# EAGLE design PCB (EAGLE 6.5.0)
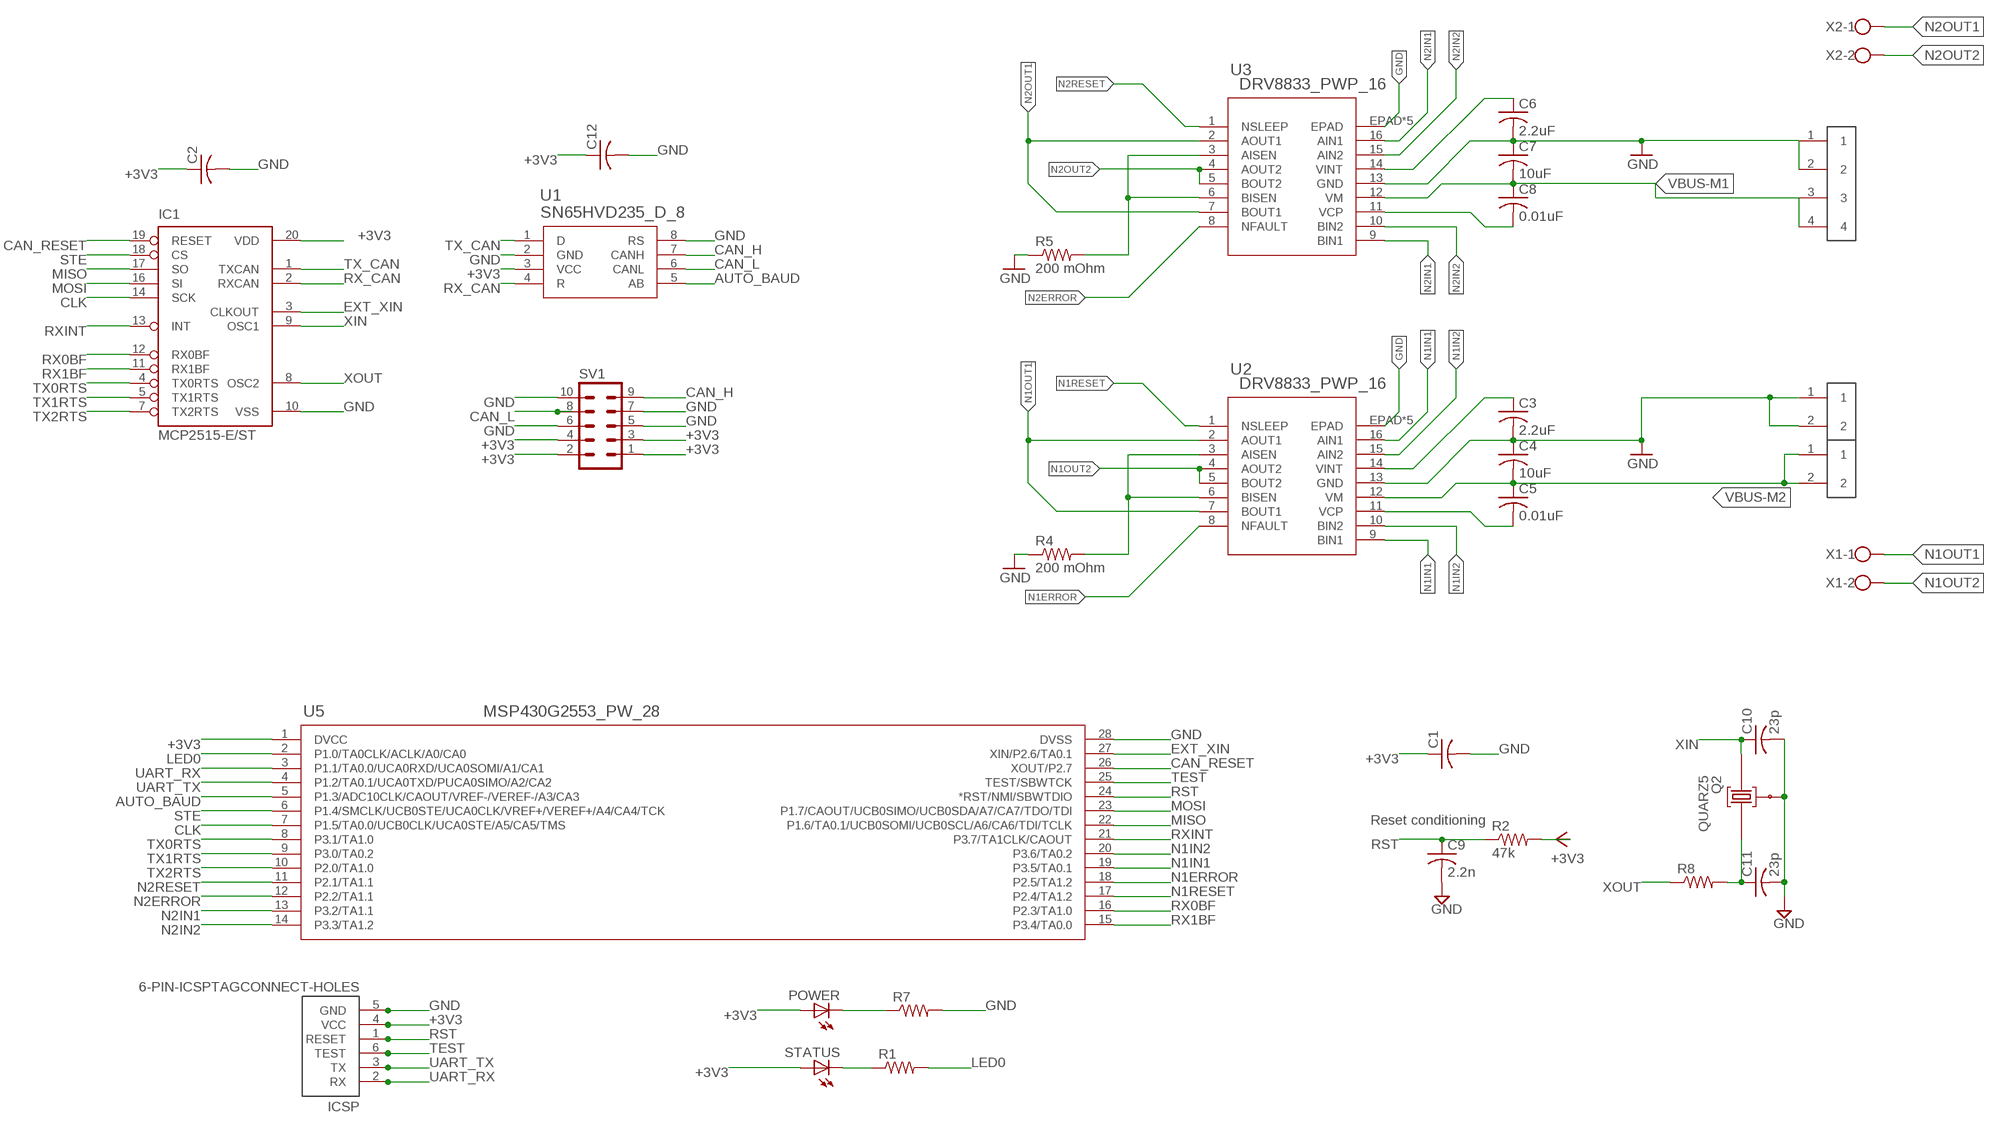
[diagram p0: schematic, sheet 1]

## Parts
C1  C-USC0603  [C0603]
C2  C-USC0603  [C0603]
C3  2.2uF  C-USC1206  [C1206]
C4  10uF  C-USC1206  [C1206]
C5  0.01uF  C-USC1206  [C1206]
C6  2.2uF  C-USC1206  [C1206]
C7  10uF  C-USC1206  [C1206]
C8  0.01uF  C-USC1206  [C1206]
C9  2.2n  C-USC0603  [C0603]
C10  23p  C-USC1206  [C1206]
C11  23p  C-USC1206  [C1206]
C12  C-USC0603  [C0603]
IC1  MCP2515-E/ST  [TSSOP20]
ICSP  6-PIN-ICSPTAGCONNECT-HOLES  [TAGCONNECT-HOLES]
POWER  LEDCHIP-LED0603  [CHIP-LED0603]
Q2  QUARZ5  [QUARZ5]
R1  R-US_R0603  [R0603]
R2  47k  R-US_R0603  [R0603]
R4  200 mOhm  R-US_R0805  [R0805]
R5  200 mOhm  R-US_R0805  [R0805]
R7  R-US_R0603  [R0603]
R8  R-US_R0603  [R0603]
STATUS  LEDCHIP-LED0603  [CHIP-LED0603]
SV1  MA05-2  [MA05-2]
U1  SN65HVD235_D_8  [D8]
U2  DRV8833_PWP_16  [PWP16_2P31X2P46]
U3  DRV8833_PWP_16  [PWP16_2P31X2P46]
U5  MSP430G2553_PW_28  [PW28]
U$2  1X4_HEADER  [1X4-.1HEADER]
U$3  1X2_HEADER  [1X2-.1HEADER]
U$4  1X2_HEADER  [1X2-.1HEADER]
X1  W237-102  [W237-102]
X2  W237-102  [W237-102]

## Nets
+3V3: C1.1 C2.1 C12.1 IC1.20(VDD) ICSP.4(VCC) POWER.A R2.2 STATUS.A SV1.1 SV1.2 SV1.3 SV1.4 U1.3(VCC) U5.1(DVCC)
AUTO_BAUD: U1.5(AB) U5.5(P1.3/ADC10CLK/CAOUT/VREF-/VEREF-/A3/CA3)
CAN_H: SV1.9 U1.7(CANH)
CAN_L: SV1.8 U1.6(CANL)
CAN_RESET: IC1.19(RESET) U5.26(XOUT/P2.7)
CLK: IC1.14(SCK) U5.7(P1.5/TA0.0/UCB0CLK/UCA0STE/A5/CA5/TMS)
EXT_XIN: IC1.3(CLKOUT) U5.27(XIN/P2.6/TA0.1)
GND: C1.2 C2.2 C3.2 C4.1 C6.2 C7.1 C9.2 C10.2 C11.2 C12.2 IC1.10(VSS) ICSP.5(GND) Q2.GND@0 R4.1 R5.1 R7.2 SV1.5 SV1.6 SV1.7 SV1.10 U1.2(GND) U1.8(RS) U2.13(GND) U2.EPAD U2.V(EPAD) U2.V_2(EPAD) U2.V_3(EPAD) U2.V_6(EPAD) U3.13(GND) U3.EPAD U3.V(EPAD) U3.V_2(EPAD) U3.V_3(EPAD) U3.V_6(EPAD) U5.28(DVSS) U$2.1 U$2.2 U$3.1 U$3.2
LED0: R1.2 U5.2(P1.0/TA0CLK/ACLK/A0/CA0)
MISO: IC1.17(SO) U5.22(P1.6/TA0.1/UCB0SOMI/UCB0SCL/A6/CA6/TDI/TCLK)
MOSI: IC1.16(SI) U5.23(P1.7/CAOUT/UCB0SIMO/UCB0SDA/A7/CA7/TDO/TDI)
N1ERROR: U2.8(NFAULT) U5.18(P2.5/TA1.2)
N1IN1: U2.9(BIN1) U2.16(AIN1) U5.19(P3.5/TA0.1)
N1IN2: U2.10(BIN2) U2.15(AIN2) U5.20(P3.6/TA0.2)
N1OUT1: U2.2(AOUT1) U2.7(BOUT1) X1.1
N1OUT2: U2.4(AOUT2) U2.5(BOUT2) X1.2
N1RESET: U2.1(NSLEEP) U5.17(P2.4/TA1.2)
N1SENSE: R4.2 U2.3(AISEN) U2.6(BISEN)
N1SENSE1: R5.2 U3.3(AISEN) U3.6(BISEN)
N1VINT: C3.1 U2.14(VINT)
N2ERROR: U3.8(NFAULT) U5.12(P2.2/TA1.1)
N2IN1: U3.9(BIN1) U3.16(AIN1) U5.13(P3.2/TA1.1)
N2IN2: U3.10(BIN2) U3.15(AIN2) U5.14(P3.3/TA1.2)
N2OUT1: U3.2(AOUT1) U3.7(BOUT1) X2.1
N2OUT2: U3.4(AOUT2) U3.5(BOUT2) X2.2
N2RESET: U3.1(NSLEEP) U5.11(P2.1/TA1.1)
N2VCP: C8.2 U3.11(VCP)
N2VINT: C6.1 U3.14(VINT)
N$2: R1.1 STATUS.C
N$4: C5.2 U2.11(VCP)
N$5: POWER.C R7.1
RST: C9.1 ICSP.1(RESET) R2.1 U5.24(*RST/NMI/SBWTDIO)
RX0BF: IC1.12(RX0BF) U5.16(P2.3/TA1.0)
RX1BF: IC1.11(RX1BF) U5.15(P3.4/TA0.0)
RX_CAN: IC1.2(RXCAN) U1.4(R)
RXINT: IC1.13(INT) U5.21(P3.7/TA1CLK/CAOUT)
STE: IC1.18(CS) U5.6(P1.4/SMCLK/UCB0STE/UCA0CLK/VREF+/VEREF+/A4/CA4/TCK)
TEST: ICSP.6(TEST) U5.25(TEST/SBWTCK)
TX0RTS: IC1.4(TX0RTS) U5.8(P3.1/TA1.0)
TX1RTS: IC1.5(TX1RTS) U5.9(P3.0/TA0.2)
TX2RTS: IC1.7(TX2RTS) U5.10(P2.0/TA1.0)
TX_CAN: IC1.1(TXCAN) U1.1(D)
UART_RX: ICSP.2(RX) U5.3(P1.1/TA0.0/UCA0RXD/UCA0SOMI/A1/CA1)
UART_TX: ICSP.3(TX) U5.4(P1.2/TA0.1/UCA0TXD/PUCA0SIMO/A2/CA2)
VBUS-M1: C7.2 C8.1 U3.12(VM) U$2.3 U$2.4
VBUS-M2: C4.2 C5.1 U2.12(VM) U$4.1 U$4.2
XIN: C10.1 IC1.9(OSC1) Q2.2
XOUT: IC1.8(OSC2) R8.1
XOUT_C: C11.1 Q2.1 R8.2

## Notes on the sheet
- Reset conditioning

## Library data of the parts
C1-C12 = adafruit:C-US: CAPACITOR, American symbol
IC1 = mcp2515:MCP2515
ICSP = LaunchFET:6-PIN-ICSP: 6 pin easy-msp formatted headers. Designed to make programming target boards with MSP430 Launchpad easier. EASYMSP: standard .05" pitch header to match launchpad SAFEMSP: .05" header with .025" offset Vcc to keep Geordi away
POWER STATUS = adafruit:LED: LED OSRAM: - CHIPLED LG R971, LG N971, LY N971, LG Q971, LY Q971, LO R971, LY R971 LH N974, LH R974 LS Q976, LO Q976, LY Q976 LO Q996 - Hyper CHIPLED LW Q18S LB Q993, LB Q99A, LB R99A - SideLED LS A670, LO A670, LY A670, LG A670, LP A670 LB A673, LV A673, LT A673, LW A673 LH A674 LY A675 LS A676, LA A676, LO A676, LY A676, LW A676 LS A679, LY A679, LG A679 - Hyper Micro SIDELED® LS Y876, LA Y876, LO Y876, LY Y876 LT Y87S - SmartLED LW L88C, LW L88S LB L89C, LB L89S, LG L890 LS L89K, LO L89K, LY L89K LS L896, LA L896, LO L896, LY L896 - TOPLED LS T670, LO T670, LY T670, LG T670, LP T670 LSG T670, LSP T670, LSY T670, LOP T670, LYG T670 LG T671, LOG T671, LSG T671 LB T673, LV T673, LT T673, LW T673 LH T674 LS T676, LA T676, LO T676, LY T676, LB T676, LH T676, LSB T676, LW T676 LB T67C, LV T67C, LT T67C, LS T67K, LO T67K, LY T67K, LW E67C LS E67B, LA E67B, LO E67B, LY E67B, LB E67C, LV E67C, LT E67C LW T67C LS T679, LY T679, LG T679 LS T770, LO T770, LY T770, LG T770, LP T770 LB T773, LV T773, LT T773, LW T773 LH T774 LS E675, LA E675, LY E675, LS T675 LS T776, LA T776, LO T776, LY T776, LB T776 LHGB T686 LT T68C, LB T68C - Hyper Mini TOPLED® LB M676 - Mini TOPLED Santana® LG M470 LS M47K, LO M47K, LY M47K Source: http://www.osram.convergy.de/
Q2 = sMSP430:QUARZ5
R1 R2 R4 R5 R7 R8 = adafruit:R-US_: RESISTOR, American symbol
SV1 = con-lstb:MA05-2: PIN HEADER; OC_FARNELL: unknown; OC_NEWARK: unknown
U1 = TexasInstruments:SN65HVD235_D_8; DATASHEETURL: http://www.ti.com/lit/gpn/SN65HVD235; DESCRIPTION: 3.3V CAN with Standby Mode, Autobaud Loop-back; FAMILY_NAME: CAN; GENERIC_PART_NUMBER: SN65HVD235; INDUSTRY_STD_PKG_TYPE: SOIC; MANUFACTURER: Texas Instruments; MANUFACTURER_PART_NUMBER: sn65hvd235_d_8; PACKAGE_DESIGNATOR: D; PIN_COUNT: 8; VENDOR: Texas Instruments
U2 U3 = TI:DRV8833_PWP_16; DATASHEETURL: http://www.ti.com/lit/gpn/DRV8833; DESCRIPTION: 2A Low Voltage Dual Brushed DC or Single Bipolar Stepper Motor Driver (PWM Ctrl); FAMILY_NAME: BRUSHED DC DRIVER; GENERIC_PART_NUMBER: DRV8833; INDUSTRY_STD_PKG_TYPE: HTSSOP; MANUFACTURER: Texas Instruments; MANUFACTURER_PART_NUMBER: drv8833_pwp_16; PACKAGE_DESIGNATOR: PWP; PIN_COUNT: 16; VENDOR: Texas Instruments
U5 = TexasInstruments:MSP430G2553_PW_28; DATASHEETURL: http://www.ti.com/lit/gpn/MSP430G2553; DESCRIPTION: MSP430G2x53, MSP430G2x13 Mixed Signal Microcontroller; FAMILY_NAME: Value Line; GENERIC_PART_NUMBER: MSP430G2553; INDUSTRY_STD_PKG_TYPE: TSSOP; MANUFACTURER: Texas Instruments; MANUFACTURER_PART_NUMBER: msp430g2553_pw_28; PACKAGE_DESIGNATOR: PW; PIN_COUNT: 28; VENDOR: Texas Instruments
U$2 = connectors:1X4_HEADER
U$3 U$4 = connectors:1X2_HEADER
X1 X2 = con-wago-500:W237-102: WAGO SCREW CLAMP; MPN: 237-102; OC_FARNELL: unknown; OC_NEWARK: 70K9898

## Board
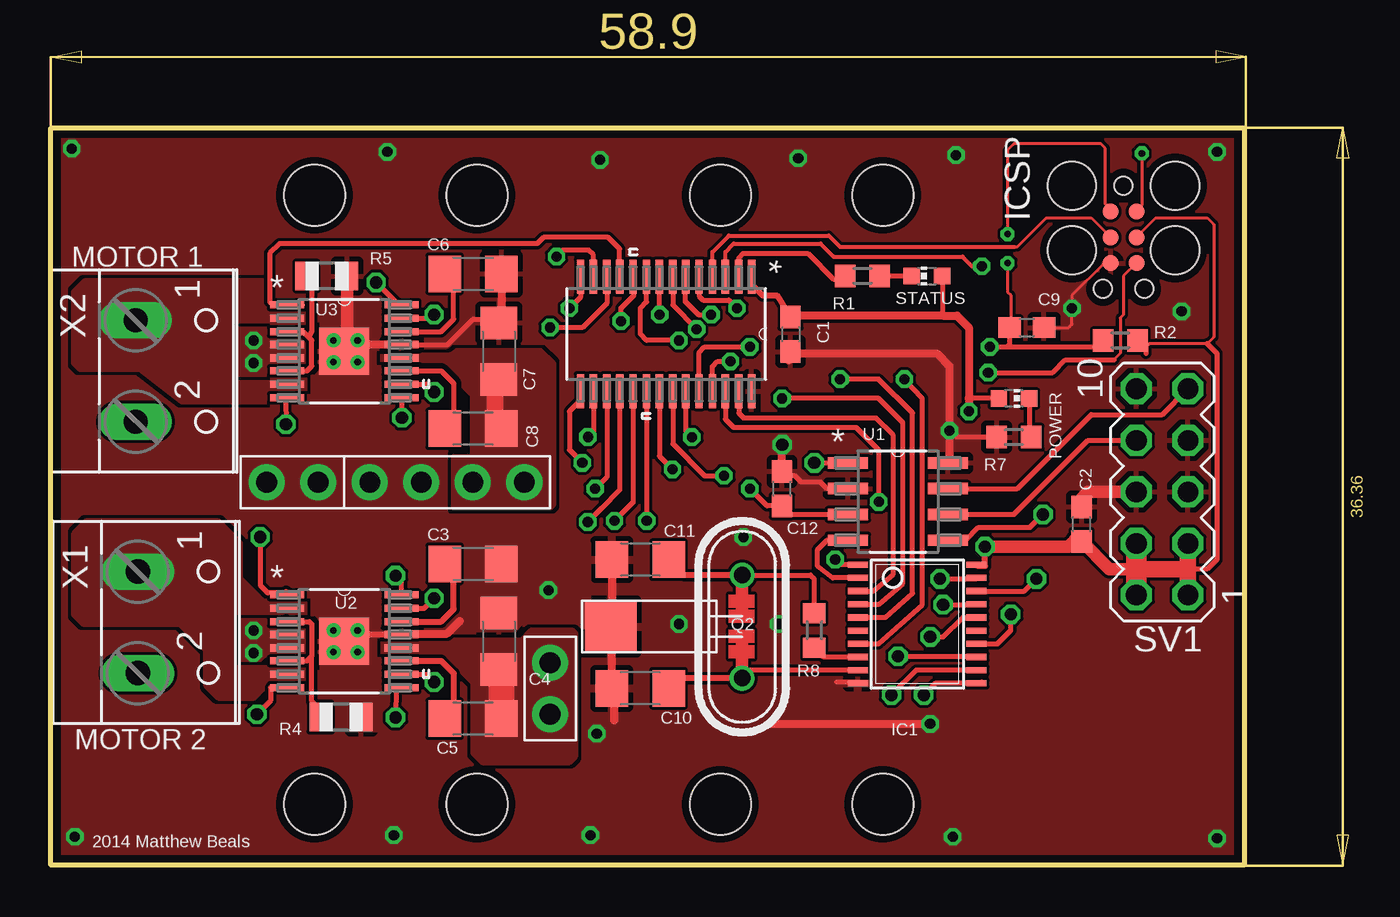
[diagram p1: board, top side]
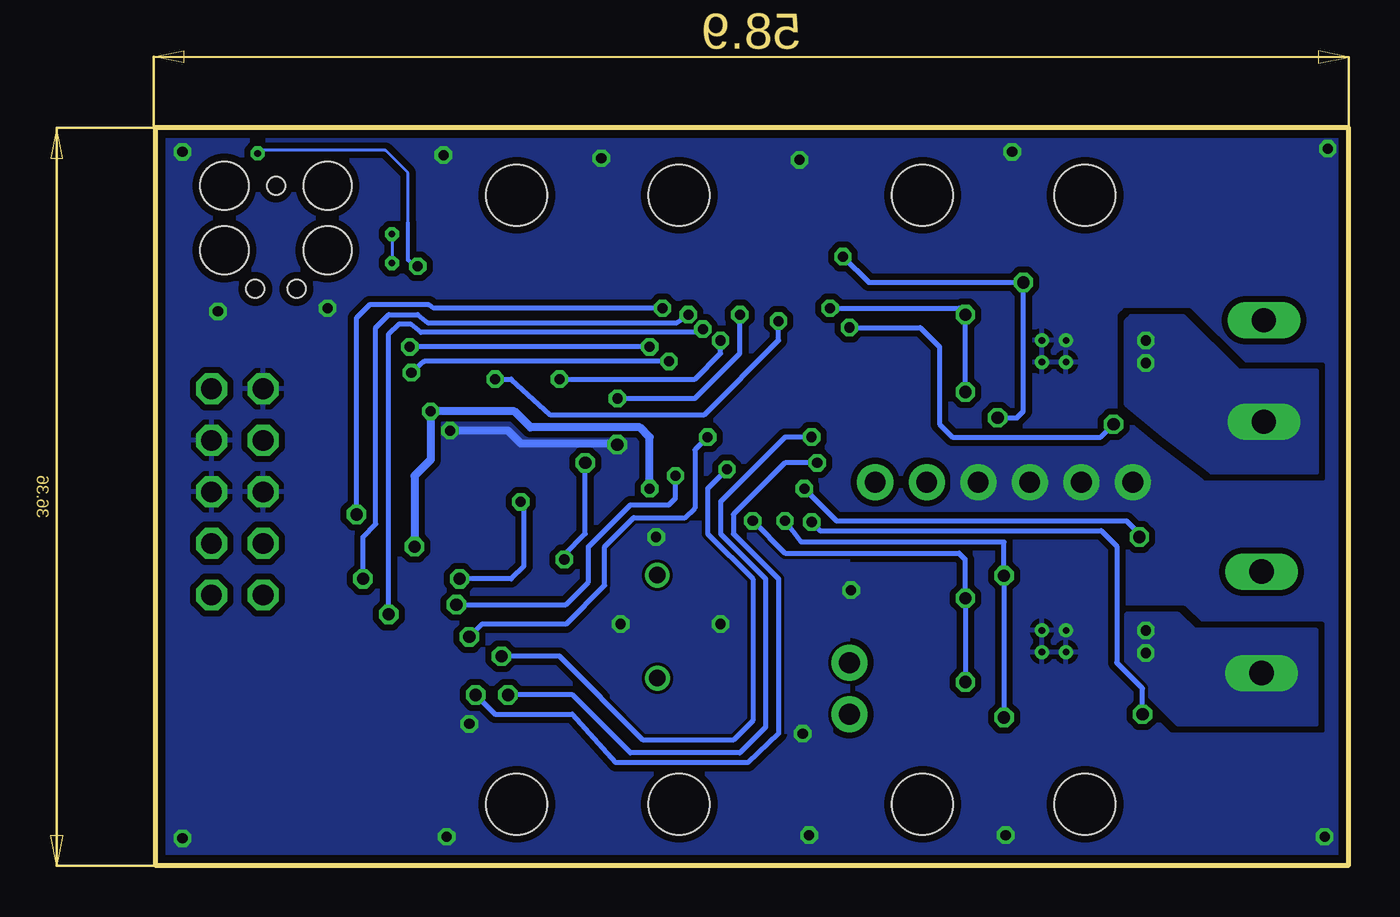
[diagram p2: board, bottom side, seen from below]

Size 58.81 x 36.32 mm. Coordinates in mm from the lower left corner, seen from the top.
Outline: 0,36.32 58.81,36.32 58.81,0 0,0 0,36.32
Copper layers (1*16): Top 0.0356mm / dielectric 1.5011mm / Bottom 0.0356mm
Design rules "oshpark": minimum track width 6mil, minimum drill 13mil, track to track 6mil, track to pad 6mil, pad to pad 6mil, via to via 6mil, smd to smd 6mil, copper to edge 15mil, drill to drill 6mil, minimum pad ring 7mil, minimum via ring 7mil, stop-mask expansion 4mil, vias tented up to drill 0mil, thermal gap 10mil
Holes 3 mm at 13,33 13,3 33,33 33,3 21,33 21,3 41,3 41,33

### Footprints (pad centres in the part's own frame; a part is rotated, then mirrored left to right if it is on the bottom)
C0603 = smd 1.1 x 1: 1 -0.85,0; 2 0.85,0
C1206 = smd 1.6 x 1.8: 1 -1.4,0; 2 1.4,0
TSSOP20 = smd 0.305 x 0.991: 1 -2.925,-2.918; 2 -2.275,-2.918; 3 -1.625,-2.918; 4 -0.975,-2.918; 5 -0.325,-2.918; 6 0.325,-2.918; 7 0.975,-2.918; 8 1.625,-2.918; 9 2.275,-2.918; 10 2.925,-2.918; 11 2.925,2.918; 12 2.275,2.918; 13 1.625,2.918; 14 0.975,2.918; 15 0.325,2.918; 16 -0.325,2.918; 17 -0.975,2.918; 18 -1.625,2.918; 19 -2.275,2.918; 20 -2.925,2.918
TAGCONNECT-HOLES = smd 0.787 x 0.787: 1 -1.27,-0.635; 2 -1.27,0.635; 3 0,-0.635; 4 0,0.635; 5 1.27,-0.635; 6 1.27,0.635 | hole 0.889: -2.54,0; 2.54,-1.016; 2.54,1.016 | hole 2.375: -2.54,2.54; -2.54,-2.54; 0.635,-2.54; 0.635,2.54
CHIP-LED0603 = smd 0.8 x 0.8: A 0,-0.75; C 0,0.75
QUARZ5 = drill 0.813: 1 1.53,1.773; 2 1.52,-3.303 | smd 2.54 x 2.54: GND@0 -4.941,-0.762
R0603 = smd 1 x 1.1: 1 -0.85,0; 2 0.85,0
R0805 = smd 1.1 x 1.4: 1 -1,0; 2 1,0
MA05-2 = drill 1.016 octagon: 1 -5.08,-1.27; 2 -5.08,1.27; 3 -2.54,-1.27; 4 -2.54,1.27; 5 0,-1.27; 6 0,1.27; 7 2.54,-1.27; 8 2.54,1.27; 9 5.08,-1.27; 10 5.08,1.27
D8 = smd 1.981 x 0.559: 1 -2.464,1.905; 2 -2.464,0.635; 3 -2.464,-0.635; 4 -2.464,-1.905; 5 2.464,-1.905; 6 2.464,-0.635; 7 2.464,0.635; 8 2.464,1.905
PWP16_2P31X2P46 = smd 1.676 x 0.356: 1 -2.819,2.286; 2 -2.819,1.626; 3 -2.819,0.965; 4 -2.819,0.33; 5 -2.819,-0.33; 6 -2.819,-0.965; 7 -2.819,-1.626; 8 -2.819,-2.286; 9 2.819,-2.286; 10 2.819,-1.626; 11 2.819,-0.965; 12 2.819,-0.33; 13 2.819,0.33; 14 2.819,0.965; 15 2.819,1.626; 16 2.819,2.286 | smd 2.464 x 2.311: EPAD 0,0 | drill 0.33: V 0.66,0.533; V_2 -0.533,0.533; V_3 -0.533,-0.533; V_6 0.66,-0.533
PW28 = smd 1.676 x 0.356: 1 -2.819,4.216; 2 -2.819,3.581; 3 -2.819,2.921; 4 -2.819,2.286; 5 -2.819,1.626; 6 -2.819,0.965; 7 -2.819,0.33; 8 -2.819,-0.33; 9 -2.819,-0.965; 10 -2.819,-1.626; 11 -2.819,-2.286; 12 -2.819,-2.921; 13 -2.819,-3.581; 14 -2.819,-4.216; 15 2.819,-4.216; 16 2.819,-3.581; 17 2.819,-2.921; 18 2.819,-2.286; 19 2.819,-1.626; 20 2.819,-0.965; 21 2.819,-0.33; 22 2.819,0.33; 23 2.819,0.965; 24 2.819,1.626; 25 2.819,2.286; 26 2.819,2.921; 27 2.819,3.581; 28 2.819,4.216
1X4-.1HEADER = drill 1.016 pad 1.778: 1 -5.08,0; 2 -2.54,0; 3 0,0; 4 2.54,0
1X2-.1HEADER = drill 1.016 pad 1.778: 1 -2.54,0; 2 0,0
W237-102 = drill 1.194 long: 1 -2.5,-1.27; 2 2.5,-1.27

### Placement (x,y rotation side)
C1  36.46,26.15 270 top
C2  50.8,16.8 90 top
C3  20.82,14.84 0 top
C4  22.09,11.03 270 top
C5  20.82,7.22 180 top
C6  20.82,29.13 0 top
C7  22.09,25.32 270 top
C8  20.82,21.51 180 top
C9  48.1,26.48 0 top
C10  29.05,8.7 180 top
C11  29.05,15.05 180 top
C12  36.04,18.55 90 top
IC1  42.7,11.88 270 top
ICSP  52.87,30.93 270 top
POWER  47.47,22.99 270 top
Q2  32.55,12.52 0 top
R1  40.01,29.03 180 top
R2  52.71,25.85 0 top
R4  14.31,7.29 180 top
R5  13.61,29.02 180 top
R7  47.47,21.09 180 top
R8  37.62,11.56 90 top
STATUS  43.18,29.03 90 top
SV1  54.77,18.39 90 top
U1  41.75,17.91 0 top
U2  14.46,11.03 0 top
U3  14.46,25.32 0 top
U5  30.32,26.17 270 top
U$2  20.8,18.87 0 top
U$3  13.18,18.87 0 top
U$4  24.61,7.44 270 top
X1  5.56,11.96 270 top
X2  5.45,24.34 270 top

### Tracks (layer width: path | path; a pad name or v marks a point on that pad's centre or on a via)
+3V3  (via drill 0.5, 0.6)
  Top 0.152: 53.98,25.53 54.14,25.69 56.99,25.69 57.31,26.01 57.31,31.56 56.99,31.88 54.45,31.88 ICSP.4
  Top 0.254: U1.3 36.35,17.28 36.04,17.59 C12.1 35.3,17.7 v34.45,18.55 | 53.98,25.22 53.98,25.53 53.98,25.69 53.82,25.85 R2.2 | STATUS.A 43.93,27.12 43.98,27.07 | 56.99,25.69 57.47,25.22 57.47,15.05 56.99,14.58 56.04,14.58 | 50.33,15.85 50.33,16.17 | POWER.A 45.24,22.99
  Top 0.305: U5.1 34.54,28.62 35.09,28.07 35.78,28.07 C1.1 | v46.04,15.69 46.04,14.74 45.69,14.74 IC1.20
  Top 0.406: v45.24,22.36 45.24,22.99 45.24,26.48 44.66,27.07 43.98,27.07 36.53,27.07 C1.1
  Top 0.61: 53.5,14.58 52.17,14.58 C2.1 50.7,15.85 50.33,15.85 50.17,15.69 v46.04,15.69
  Top 0.813: 56.04,14.58 53.5,14.58 | SV1.3 56.04,14.58 | SV1.1 56.04,14.58
  Top 1.016: SV1.4 53.5,14.58 SV1.2
  Bottom 0.406: v34.45,18.55 34.45,21.09 34.93,21.56 40.32,21.56 41.12,22.36 v45.24,22.36 45.24,19.98 46.04,19.18 v46.04,15.69
AUTO_BAUD  (via drill 0.5, 0.6)
  Top 0.254: U1.5 45.09,16.01 45.72,16.64 48.26,16.64 v48.9,17.28 | U5.5 31.95,28.03 32.15,27.83 33.42,27.83 v33.81,27.44
  Bottom 0.254: v48.9,17.28 48.9,26.96 48.26,27.6 45.32,27.6 45.09,27.44 v33.81,27.44
CAN_H
  Top 0.254: U1.7 47.63,18.55 51.28,22.2 54.77,22.2 SV1.9
CAN_L
  Top 0.254: U1.6 47.47,17.28 51.12,20.93 SV1.8
CAN_RESET  (via drill 0.5, 0.6)
  Top 0.254: U5.26 33.24,21.98 33.66,21.56 39.69,21.56 40.8,20.45 40.8,17.97 v40.8,17.9 | v43.82,14.1 45.57,14.1 IC1.19
  Bottom 0.254: v43.82,14.1 41.28,14.1 40.64,14.74 40.64,17.81 v40.8,17.9
CLK  (via drill 0.5, 0.6)
  Top 0.254: IC1.14 46.65,10.91 47.31,11.56 v47.31,12.36 | U5.7 30.65,27.58 v31.83,26.41
  Bottom 0.254: v47.31,12.36 47.31,26.17 46.83,26.64 46.2,26.64 45.72,26.25 31.99,26.25 v31.83,26.41
EXT_XIN
  Top 0.254: IC1.3 40.52,13.51 41.51,14.34 41.51,21.17 40.64,22.04 34.13,22.04 33.9,22.27 U5.27
GND  (via drill 0.5, 0.6)
  Top 0.152: C9.2 50.17,26.48 50.33,26.64 v50.33,27.44 50.33,28.07 51.91,29.66 ICSP.5
  Top 0.254: U3.13 19.56,25.65 20.82,26.91 21.9,26.91 | 15.46,26.19 U3.V | 15.56,24.35 U3.V_6 | 27.78,8.58 C10.2 | U1.2 38.26,18.55 37.94,18.87 36.99,18.87 36.67,19.18 36.25,19.18 C12.2 | 39.85,9.02 38.74,9.02 | R7.2 44.61,21.09 v44.29,21.41
  Top 0.305: 22.09,14.71 C3.2 | 21.95,12.3 C4.1 | 21.9,26.91 C7.1 | U2.13 14.8,11.36 | U5.28 34.54,24.03 | 36.29,24.9 C1.2 | 27.65,11.7 Q2.GND@0 27.65,11.8
  Top 0.406: 15.46,10.16 U2.V_6 | C6.2 22.22,26.85 C7.1 | 15.46,11.9 U2.V | C10.2 27.65,11.7 | 27.65,11.8 C11.2 27.49,14.9 | 27.78,7.12 27.78,8.58 | C12.2 36.04,20.55 v36.05,20.72 | U1.8 44.29,19.89 v44.29,21.41 44.29,24.58 43.66,25.22 36.35,25.22 36.35,24.85 C1.2 | 35.4,6.96 v43.34,6.96 | 14.8,11.36 U2.EPAD | U3.13 15.33,25.65 U3.V | 16.83,11.4 19.53,11.4 20.16,12.04
  Top 0.61: C2.2 50.8,18.07 51.12,18.39 SV1.6 | R5.1 14.61,26.37 U3.V
  Bottom 0.406: v44.29,21.41 41.44,21.41 40.8,20.77 36.1,20.77 v36.05,20.72
  other vias: 24.53,13.55 30.96,11.88 34.13,16.17 35.88,11.88 55.72,27.28 26.91,6.48 57.47,1.32 44.45,1.4 26.59,1.48 16.91,1.48 1.19,1.4 57.47,35.14 44.61,34.98 36.83,34.82 27.07,34.74 16.59,35.14 1.03,35.3
  pour Bottom (isolate 0.305, rank 2): 0,-0.03 0,36.33 58.9,36.33 58.9,-0.03
  pour Top (isolate 0.305): 26.67,16.96 26.67,6.64 40.32,6.64 40.32,9.02 36.2,9.02 36.2,15.69 35.09,16.8
  pour Bottom: 24.77,16.17 24.77,6.64 34.93,6.64 36.2,7.91 36.2,15.69 35.09,16.8 25.24,16.8 24.77,16.33
  pour Top (isolate 0.254, rank 2, no thermals): 13.02,26.64 16.04,26.64 16.04,20.77 16.83,20.14 18.89,20.14 19.37,19.82 19.37,17.75 19.05,17.59 19.69,16.96 25.4,16.96 26.51,15.85 26.51,12.04 26.35,11.88 23.34,11.88 22.7,11.24 16.51,11.24 16.51,11.56 19.37,11.56 20.64,12.83 20.64,16.01 17.78,16.01 17.62,15.85 17.15,15.53 16.51,14.9 16.35,6.64 12.86,6.64 13.02,14.58 9.37,17.59 9.37,20.14 11.59,20.14 13.02,21.56
  pour Top (rank 6): 0,36.33 58.9,36.33 58.74,-0.03 0,-0.03
  pour Bottom (no thermals): 9.37,20.14 19.53,20.14 19.53,17.59 9.37,17.59
LED0
  Top 0.254: U5.2 33.9,29.91 34.13,30.14 37.31,30.14 38.58,28.87 39,28.87 R1.2
MISO  (via drill 0.5, 0.6)
  Top 0.254: U5.22 30.65,20.76 32.23,19.18 v33.18,19.18 | v43.98,12.83 45.6,12.83 IC1.17
  Bottom 0.254: v43.98,12.83 38.58,12.83 37.47,13.94 37.47,15.69 35.4,17.75 33.5,17.75 33.18,18.07 v33.18,19.18
MOSI  (via drill 0.5, 0.6)
  Top 0.254: U5.23 31.29,21.39 v31.59,21.09 | v43.34,11.24 43.98,11.24 44.93,12.2 45.62,12.2 IC1.16
  Bottom 0.254: v31.59,21.09 32.23,20.45 32.23,17.59 32.7,17.12 35.24,17.12 36.67,15.69 36.67,13.78 38.58,11.88 42.7,11.88 v43.34,11.24
N1ERROR  (via drill 0.5, 0.6)
  Top 0.254: U5.18 28.04,18.48 27.15,17.59 v26.46,16.9 | U2.8 10.84,8.74 10.84,8.11 v10.16,7.44
  Bottom 0.254: v26.46,16.9 v26.45,16.9 26.07,16.48 12.19,16.48 11.43,15.72 11.43,9.98 10.16,8.7 v10.16,7.44
N1IN1  (via drill 0.5, 0.6)
  Top 0.254: U2.9 17.03,8.74 v16.99,7.28 | U2.16 17.28,13.96 v16.99,14.26 | U5.19 28.7,17.87 v27.78,16.96
  Bottom 0.254: v27.78,16.96 26.99,15.93 16.99,15.93 v16.99,14.26 v16.99,7.28
N1IN2  (via drill 0.5, 0.6)
  Top 0.254: U2.15 18.4,12.66 v18.89,13.15 | U2.10 18.51,9.4 v18.89,9.02 | U5.20 29.36,16.97 v29.37,16.96
  Bottom 0.254: v18.89,9.02 v18.89,13.15 18.89,15.05 19.21,15.37 27.78,15.37 v29.37,16.96
N1OUT1
  pour Top (rank 2, no thermals): 12.54,12.99 10.48,12.99 9.37,14.1 9.37,15.85 8.26,16.96 1.75,16.96 1.11,16.33 1.11,12.36 1.59,11.88 6.35,11.88 7.62,10.61 7.62,8.86 8.26,8.23 10,8.23 10.95,9.18 12.54,9.18
N1OUT2  (via drill 0.5)
  other vias: 10,11.56 10,10.45
  pour Top (no thermals): 12.54,11.56 11.11,11.56 10.64,12.04 9.37,12.04 9.37,10.13 10.32,10.13 10.64,10.45 12.54,10.45
  pour Bottom (no thermals): 10.95,12.36 10.95,9.5 8.41,6.96 1.59,6.96 1.59,7.59 1.59,10.93 1.59,11.56 7.62,11.56 8.41,12.36
N1RESET  (via drill 0.5, 0.6)
  Top 0.254: 11.65,13.41 10.69,13.41 10.32,13.78 v10.32,16.17 | U5.17 27.4,19.12 v26.83,18.55
  Top 0.305: U2.1 11.65,13.41 11.59,13.47
  Bottom 0.254: v26.83,18.55 25.24,16.96 10.95,16.96 10.32,16.33 v10.32,16.17
N1SENSE
  Top 0.254: U2.3 12.75,11.99 12.86,11.88 12.86,10.45 12.86,10.29 | U2.6 12.63,10.06 12.86,10.29 | R4.2 13.31,7.62 12.86,8.07 12.86,10.29
  Top 0.305: U2.3 11.59,12.06
N1SENSE1
  Top 0.254: U3.6 12.63,24.35 12.86,24.58 12.86,25.85 12.7,26.01 | U3.3 12.43,26.28 12.7,26.01 | R5.2 12.61,28.64 12.86,28.39 12.86,26.33 12.7,26.01
N1VINT
  Top 0.305: U2.14 19.24,11.99 19.86,12.62 19.86,14.71 C3.1
N2ERROR  (via drill 0.5, 0.6)
  Top 0.254: U3.8 11.57,22.97 v11.59,21.72 | U5.12 27.4,27.69 26.2,26.48 v24.61,26.48
  Bottom 0.254: v24.61,26.48 21.11,26.48 20.16,25.53 20.16,21.72 19.53,21.09 12.23,21.09 v11.59,21.72
N2IN1  (via drill 0.5, 0.6)
  Top 0.254: U3.9 17.28,22.06 v17.3,22.04 | U3.16 17.14,27.6 v16.04,28.71 | U5.13 26.74,30.07 26.51,30.3 25.24,30.3 v24.92,29.98
  Bottom 0.254: v17.3,22.04 16.35,22.04 16.04,22.36 v16.04,28.71 23.66,28.71 v24.92,29.98
N2IN2  (via drill 0.5, 0.6)
  Top 0.254: U3.10 18.51,23.69 v18.89,23.31 | U3.15 18.72,26.94 v18.89,27.12 | U5.14 26.11,27.98 v25.56,27.44
  Bottom 0.254: v18.89,23.31 v18.89,27.12 19.21,27.44 v25.56,27.44
N2OUT1
  Top 0.61: 4.28,26.94 X2.1
  pour Top (rank 5, no thermals): 12.54,27.28 10.8,27.28 10.8,28.79 1.67,28.79 1.11,28.23 1.11,24.74 1.43,24.42 4.37,24.42 6.43,22.83 12.54,22.83
N2OUT2  (via drill 0.5)
  other vias: 10,25.85 10,24.74
  pour Top (rank 4, no thermals): 12.54,25.86 10.8,25.86 10.64,26.02 10.64,26.41 9.21,26.41 9.21,24.19 10.72,24.19 10.72,24.75 12.54,24.75
  pour Bottom (no thermals): 6.75,19.35 9.13,21.17 10.96,22.68 10.96,26.81 10.72,27.05 8.18,27.05 5.48,24.35 1.59,24.35 1.59,23.63 1.59,19.98 1.59,19.35
N2RESET
  Top 0.254: 12.39,27.6 U3.1 11.64,27.6 10.95,27.6 10.8,27.75 10.8,30.14 11.27,30.61 23.97,30.61 24.29,30.93 27.47,30.93 28.04,30.36 U5.11
N2VCP
  Top 0.254: U3.11 19.24,24.35 19.86,23.73 19.86,21.32
  Top 0.305: 19.86,21.32 C8.2
N2VINT
  Top 0.254: U3.14 19.24,26.28 19.86,26.91 19.86,28.68
  Top 0.305: 19.86,28.68 C6.1
N$2
  Top 0.254: R1.1 STATUS.C
N$4
  Top 0.305: U2.11 19.24,10.06 19.86,9.44 19.86,7.35 C5.2
N$5
  Top 0.254: POWER.C 48.22,21.19 R7.1
RST  (via drill 0.33, 0.5)
  Top 0.152: 47.31,26.54 47.31,28.07 47.15,28.23 v47.15,29.66 | ICSP.1 52.23,32.36 52.07,32.52 52.02,32.52 51.97,32.56 51.97,35.31 51.75,35.53 47.47,35.53 47.15,35.22 v47.15,31.09
  Top 0.254: U5.24 31.95,25.25 32.23,25.53 v34.45,25.53 | v46.28,25.53 47.15,25.53 | 47.15,25.53 51.38,25.53 R2.1 | 47.15,25.53 47.25,25.64 C9.1 47.31,26.54
  Bottom 0.152: v47.15,31.09 v47.15,29.66
  Bottom 0.254: v34.45,25.53 v46.28,25.53
RX0BF  (via drill 0.5, 0.6)
  Top 0.254: U5.16 26.74,21.36 v26.47,21.09 | IC1.12 42.65,9.6 v41.44,8.39
  Bottom 0.254: v26.47,21.09 27.78,21.09 30.96,17.91 30.96,16.33 28.73,14.1 28.73,6.8 30.01,5.53 35.4,5.53 38.26,8.39 v41.44,8.39
RX1BF  (via drill 0.5, 0.6)
  Top 0.254: 45.88,9.02 45.81,8.95 IC1.11 43.59,8.95 v43.02,8.39 | U5.15 26.11,22.9 25.56,22.36 25.56,20.45 v26.2,19.82
  Bottom 0.254: v43.02,8.39 42.07,7.44 38.26,7.44 36.12,5.05 29.61,5.05 28.1,6.48 28.1,14.1 30.32,16.33 30.32,17.28 27.78,19.82 v26.2,19.82
RX_CAN
  Top 0.254: IC1.2 38.52,14.16 37.78,14.74 37.78,15.53 38.26,16.01 U1.4
RXINT  (via drill 0.5, 0.6)
  Top 0.254: U5.21 29.99,20.15 v30.64,19.5 | v41.75,10.29 45.59,10.29 IC1.13
  Bottom 0.254: v30.64,19.5 31.59,18.55 31.59,16.33 29.37,14.1 29.37,7.12 30.32,6.16 34.77,6.16 38.9,10.29 v41.75,10.29
STE  (via drill 0.5, 0.6)
  Top 0.254: IC1.18 47.98,13.51 v48.58,14.1 | U5.6 31.27,28.97 31.27,27.75 31.91,27.12 v32.55,27.12
  Bottom 0.254: v48.58,14.1 48.58,16.17 47.94,16.8 47.94,26.48 47.31,27.12 45.88,27.12 45.4,26.72 33.1,26.72 v32.55,27.12
TEST  (via drill 0.5)
  Top 0.152: 52.39,24.9 52.71,25.22 52.71,26.96 52.87,27.12 52.87,29.03 ICSP.6
  Top 0.254: U5.25 32.61,24.56 32.86,24.82 v33.5,24.82 | v46.2,24.26 49.37,24.26 50.01,24.9 52.39,24.9
  Bottom 0.254: v33.5,24.82 45.56,24.82 v46.2,24.26
TX0RTS  (via drill 0.5)
  Top 0.254: IC1.4 40.82,12.85 41.99,13.86 41.99,21.8 40.8,22.99 v36.04,22.99 | v30.01,27.12 30.01,28.97 U5.8
  Bottom 0.254: v36.04,22.99 32.23,22.99 30.01,25.22 v30.01,27.12
TX1RTS  (via drill 0.5)
  Top 0.254: IC1.5 41.12,12.2 42.47,13.39 42.47,22.28 40.8,23.94 v38.9,23.94 | v30.96,25.85 29.37,25.85 29.05,26.17 29.05,27.44 29.37,27.75 29.37,28.97 U5.9
  Bottom 0.254: v38.9,23.94 32.23,23.94 30.96,25.22 v30.96,25.85
TX2RTS  (via drill 0.5)
  Top 0.254: IC1.7 40.78,10.91 42.94,12.83 42.94,22.99 v42.07,23.94 | v28.1,26.8 28.1,27.44 28.73,28.07 28.73,28.95 U5.10
  Bottom 0.254: v42.07,23.94 41.28,23.94 39.37,22.2 31.75,22.2 28.1,25.85 v28.1,26.8
TX_CAN  (via drill 0.5, 0.6)
  Top 0.254: IC1.1 38.99,14.8 v38.66,15.05 | v37.62,19.82 U1.1
  Bottom 0.254: v37.62,19.82 37.62,16.33 38.66,15.29 v38.66,15.05
UART_RX  (via drill 0.33, 0.5)
  Top 0.152: v53.77,35.06 53.77,32.52 ICSP.2
  Top 0.198: U5.3 33.24,30.2 33.66,30.61 37.94,30.61 38.58,29.98 44.93,29.98 45.4,29.5 v45.88,29.5
  Bottom 0.152: 46.36,31.64 46.36,34.11 47.47,35.22 53.66,35.22 v53.77,35.06
  Bottom 0.198: v45.88,29.5 46.04,29.5 46.36,29.82 46.36,31.64
UART_TX
  Top 0.152: 47.47,30.45 47.63,30.45 49.05,31.88 51.28,31.88 ICSP.3
  Top 0.198: U5.4 32.61,30.2 33.42,31.01 38.34,31.01 38.9,30.45 47.47,30.45
VBUS-M1
  Top 0.305: 21.9,23.73 C7.2
  Top 0.813: 21.9,23.73 21.9,21.83 C8.1
  pour Top (isolate 0.254, no thermals): 16.35,25.37 24.13,25.37 24.77,24.74 24.77,17.75 24.61,17.59 19.84,17.59 19.84,20.14 20.8,20.14 20.8,23.15 19.53,24.42 16.35,24.42
VBUS-M2
  Top 0.305: 21.95,9.76 C4.2 21.81,9.35
  Top 0.61: 22.22,6.66 C5.1
  Top 1.27: C5.1 22.22,9.5 C4.2
  pour Top (no thermals): 16.35,10.45 19.37,10.45 20.8,9.02 20.8,5.53 21.27,5.05 25.56,5.05 25.88,5.37 25.88,11.4 25.72,11.56 23.66,11.56 23.18,11.09 16.35,11.09
XIN
  Top 0.254: IC1.9 34.46,9.6 Q2.2
  Top 0.305: Q2.2 30.96,9.21 C10.1
XOUT
  Top 0.254: IC1.8 38.08,10.26 R8.1
XOUT_C
  Top 0.254: R8.2 37.62,14.1 37.44,14.29 Q2.1
  Top 0.305: Q2.1 31.22,14.29 C11.1

### Text on the board
tStop: Motor | Cortex | V1.1
_tsilk: MOTOR 1 | MOTOR 2 | 2014 Matthew Beals